# Altium schematic sheet LTC5582.SchDoc
size A
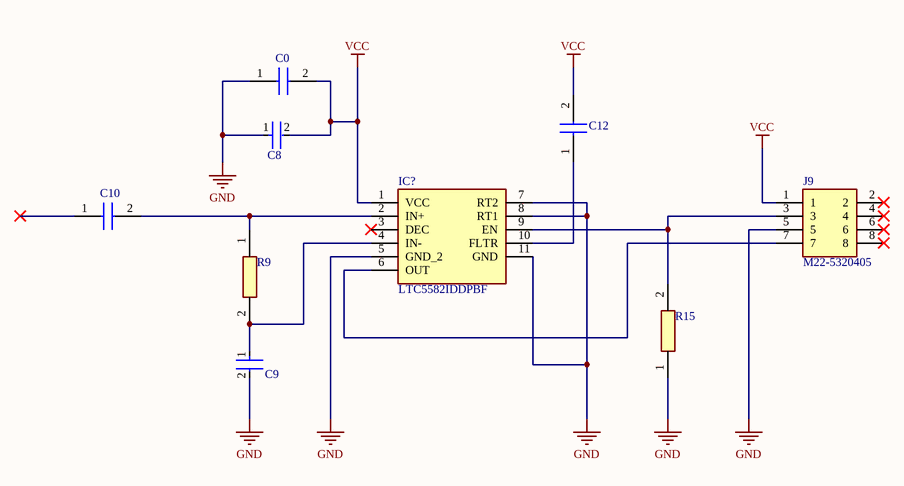
[diagram p0: LTC5582.SchDoc]

## Parts
C0  GJ821BR71H105KA12K  [CAPC2012X135N]  (value not drawn)
C8  GRM21A5C2E102FWA1J  [FP-GRM21A-0_2-MFG]  (value not drawn)
C9  GRM21A5C2E102FWA1J  [FP-GRM21A-0_2-MFG]  (value not drawn)
C10  GRM21A5C2J271FWAD  [GRM21x]  (value not drawn)
C12  GRM21BR72A104JAC4K  [CAPC2012X145N]  (value not drawn)
IC?  LTC5582IDDPBF  [DFN300X300X80-11N]
J9  M22-5320405  [HUSSP8W50P200_2X4_800X400X500P]
R9  ERA-6AEB68R1V  [ERA6AEB1020V]  (value not drawn)
R15  ERA-6APB104V  [ERA6AEB1020V]  (value not drawn)

## Nets
GND: C0.1 C8.1 C9.2 IC?.5(GND_2) IC?.7(RT2) IC?.8(RT1) IC?.11(GND) J9.5 R15.1
VCC: C0.2 C8.2 C12.2 IC?.1(VCC) J9.1
NetC9_1: C9.1 IC?.4(IN-) R9.2
NetC10_2: C10.2 IC?.2(IN+) R9.1
NetC12_1: C12.1 IC?.10(FLTR)
NetIC?_6: IC?.6(OUT) J9.7
NetIC?_9: IC?.9(EN) J9.3 R15.2

Not connected (* = marked no-connect by the designer): C10 1*; IC? 3(DEC)*; J9 2* 4* 6* 8*

## Library data of the parts
C0 = GJ821BR71H105KA12K: Capacitor; Manufacturer_Name: Murata Electronics; Datasheet Link: https://www.mouser.it/datasheet/2/281/GJ821BR71H105KA12-01-1633769.pdf; Height: 1.35mm; Manufacturer_Part_Number: GJ821BR71H105KA12K; Mouser Part Number: 81-GJ821BR71H105KA2K; Mouser Price/Stock: https://www.mouser.co.uk/ProductDetail/Murata-Electronics/GJ821BR71H105KA12K?qs=QzBtWTOodeUPH%252BEtzhwB2g%3D%3D
C8 C9 = CMP-06035-012030-1: Chip Multilayer Ceramic Capacitors for General Purpose, 0805, 1000pF, C0G, 30ppm/°C, 1%, 250V
C10 = GRM21A5C2E271FW01D: Capacitor; Manufacturer_Name: Murata Electronics; Datasheet Link: https://search.murata.co.jp/Ceramy/image/img/A01X/G101/ENG/GRM21A5C2E271FW01-01.pdf; Height: 1.25mm; Manufacturer_Part_Number: GRM21A5C2E271FW01D
C12 = GRM21BR72A104JAC4K: Capacitor; Manufacturer_Name: Murata Electronics; Datasheet Link: http://www.murata.com/~/media/webrenewal/support/library/catalog/products/capacitor/mlcc/c02e.pdf; Height: 1.45mm; Manufacturer_Part_Number: GRM21BR72A104JAC4K; Mouser Part Number: 81-GRM21BR72A104JA4K; Mouser Price/Stock: https://www.mouser.co.uk/ProductDetail/Murata-Electronics/GRM21BR72A104JAC4K?qs=QzBtWTOodeUSx9SbLZkKhw%3D%3D
IC? = LTC5582IDDPBF: Integrated Circuit; Manufacturer_Name: Analog Devices; Manufacturer_Part_Number: LTC5582IDDPBF
J9 = M22-5320405: Connector; Manufacturer_Name: Harwin; Datasheet Link: https://cdn.harwin.com/pdfs/M22-532.pdf; Manufacturer_Part_Number: M22-5320405; Mouser Part Number: 855-M22-5320405; Mouser Price/Stock: https://www.mouser.co.uk/ProductDetail/Harwin/M22-5320405?qs=WS5Jv%252B%252Bx1qVxYYIoWES7kw%3D%3D
R9 = ERA-6AEB68R1V: Resistor; Manufacturer_Name: Panasonic; Datasheet Link: https://industrial.panasonic.com/cdbs/www-data/pdf/RDM0000/AOA0000C307.pdf; Height: 0.6mm; Manufacturer_Part_Number: ERA-6AEB68R1V; Mouser Part Number: 667-ERA-6AEB68R1V; Mouser Price/Stock: https://www.mouser.com/Search/Refine.aspx?Keyword=667-ERA-6AEB68R1V
R15 = ERA-6APB104V: Resistor; Manufacturer_Name: Panasonic; Datasheet Link: https://industrial.panasonic.com/cdbs/www-data/pdf/RDM0000/AOA0000C307.pdf; Height: 0.6mm; Manufacturer_Part_Number: ERA-6APB104V; Mouser Part Number: 667-ERA-6APB104V; Mouser Price/Stock: https://www.mouser.co.uk/ProductDetail/Panasonic/ERA-6APB104V?qs=ob%252BdNz2%252BYEgDh5VhH%252BZENQ%3D%3D